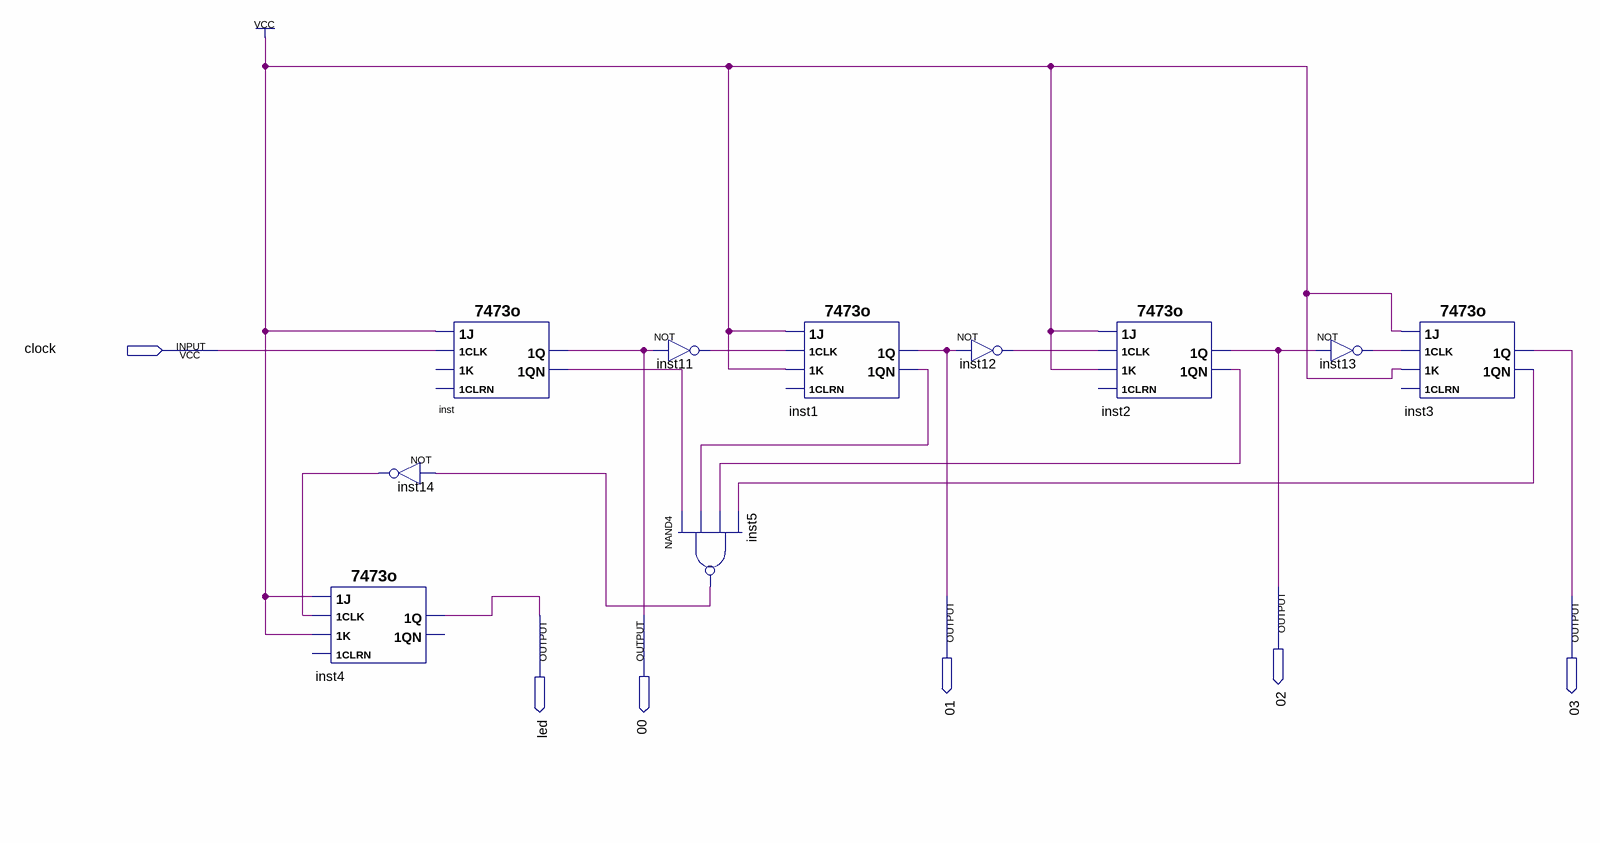
[diagram p0: schematic sheet]
// Quartus schematic lab11.bdf as structural Verilog: 10 symbols, 6 pins
module lab11 (
  input  clock,
  output \02 ,
  output \01 ,
  output \03 ,
  output led,
  output \00 
);

  wire inst1_1qn, inst2_1qn, inst3_1qn, inst5_out, inst11_out, inst12_out, inst13_out, inst14_out, inst_1qn;

  \7473o  inst4 (.\1J (1'b1), .\1CLK (inst14_out), .\1K (1'b1), .\1Q (led));  // open: 1CLRN, 1QN
  not inst14 (inst14_out, inst5_out);
  \7473o  inst (.\1J (1'b1), .\1CLK (clock), .\1QN (inst_1qn), .\1Q (\00 ));  // open: 1CLRN, 1K
  not inst11 (inst11_out, \00 );
  nand inst5 (inst5_out, inst_1qn, inst1_1qn, inst2_1qn, inst3_1qn);
  \7473o  inst1 (.\1J (1'b1), .\1CLK (inst11_out), .\1K (1'b1), .\1QN (inst1_1qn), .\1Q (\01 ));  // open: 1CLRN
  not inst12 (inst12_out, \01 );
  \7473o  inst2 (.\1J (1'b1), .\1CLK (inst12_out), .\1K (1'b1), .\1QN (inst2_1qn), .\1Q (\02 ));  // open: 1CLRN
  not inst13 (inst13_out, \02 );
  \7473o  inst3 (.\1J (1'b1), .\1CLK (inst13_out), .\1K (1'b1), .\1QN (inst3_1qn), .\1Q (\03 ));  // open: 1CLRN
endmodule
